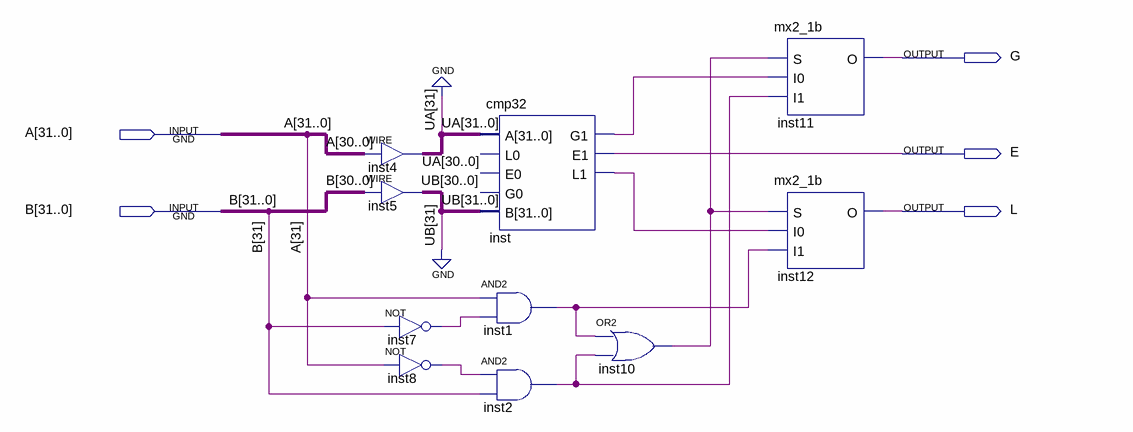
[diagram p0: schematic sheet]
// Quartus schematic cmp32s.bdf as structural Verilog: 10 symbols, 5 pins
module cmp32s (
  input  [31:0] A,
  input  [31:0] B,
  output G,
  output E,
  output L
);

  wire inst1_out, inst2_out, inst7_out, inst8_out, inst10_out, inst_g1, inst_l1;
  wire [30:0] UA, UB;

  assign UA = A[30:0];  // WIRE inst4
  assign UB = B[30:0];  // WIRE inst5
  not inst7 (inst7_out, B[31]);
  not inst8 (inst8_out, A[31]);
  cmp32 inst (.A({1'b0, UA}), .B({1'b0, UB}), .G1(inst_g1), .E1(E), .L1(inst_l1));  // open: L0, E0, G0
  and inst1 (inst1_out, A[31], inst7_out);
  and inst2 (inst2_out, inst8_out, B[31]);
  or inst10 (inst10_out, inst1_out, inst2_out);
  mx2_1b inst11 (.S(inst10_out), .I0(inst_g1), .I1(inst2_out), .O(G));
  mx2_1b inst12 (.S(inst10_out), .I0(inst_l1), .I1(inst1_out), .O(L));
endmodule
